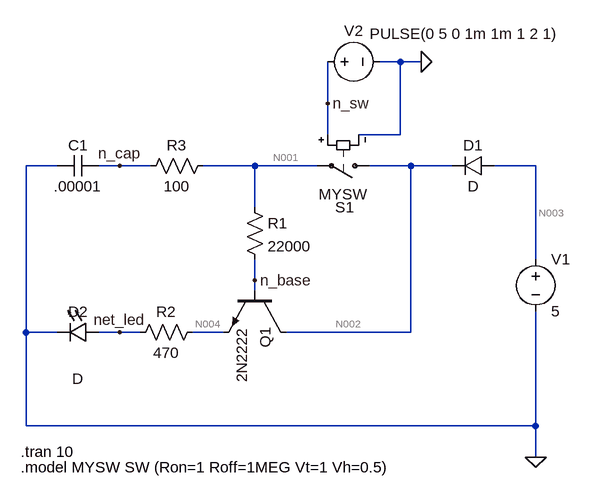
[diagram p0: schematic electronics_capacitor_drives_transistor_keeps_led_on.asc]
electronics_capacitor_drives_transistor_keeps_led_on.asc, the LTspice schematic file:
Version 4
SHEET 1 880 680
WIRE 448 -112 416 -112
WIRE 480 -112 448 -112
WIRE 336 -48 336 -112
WIRE 336 0 336 -48
WIRE 448 0 448 -112
WIRE 448 0 384 0
WIRE -80 48 -128 48
WIRE 16 48 -16 48
WIRE 64 48 16 48
WIRE 224 48 144 48
WIRE 320 48 224 48
WIRE 464 48 400 48
WIRE 528 48 464 48
WIRE 656 48 592 48
WIRE 224 112 224 48
WIRE 656 192 656 48
WIRE 224 224 224 192
WIRE 224 240 224 224
WIRE -128 304 -128 48
WIRE -80 304 -128 304
WIRE 16 304 -16 304
WIRE 48 304 16 304
WIRE 176 304 128 304
WIRE 464 304 464 48
WIRE 464 304 272 304
WIRE -128 448 -128 304
WIRE 656 448 656 272
WIRE 656 448 -128 448
WIRE 656 496 656 448
FLAG 656 496 0
FLAG 480 -112 0
FLAG 336 -48 n_sw
FLAG 16 48 n_cap
FLAG 16 304 net_led
FLAG 224 224 n_base
SYMBOL voltage 656 176 R0
WINDOW 123 0 0 Left 0
WINDOW 39 0 0 Left 0
SYMATTR InstName V1
SYMATTR Value 5
SYMBOL diode 592 32 R90
WINDOW 0 0 32 VBottom 2
WINDOW 3 32 32 VTop 2
SYMATTR InstName D1
SYMBOL npn 272 240 R90
SYMATTR InstName Q1
SYMATTR Value 2N2222
SYMBOL res 208 96 R0
SYMATTR InstName R1
SYMATTR Value 22000
SYMBOL res 144 288 R90
WINDOW 0 0 56 VBottom 2
WINDOW 3 32 56 VTop 2
SYMATTR InstName R2
SYMATTR Value 470
SYMBOL LED -16 288 R90
WINDOW 0 0 32 VBottom 2
WINDOW 3 72 32 VTop 2
SYMATTR InstName D2
SYMBOL res 160 32 R90
WINDOW 0 0 56 VBottom 2
WINDOW 3 32 56 VTop 2
SYMATTR InstName R3
SYMATTR Value 100
SYMBOL cap -16 32 R90
WINDOW 0 0 32 VBottom 2
WINDOW 3 32 32 VTop 2
SYMATTR InstName C1
SYMATTR Value .00001
SYMBOL sw 416 48 R90
WINDOW 0 64 39 VRight 2
WINDOW 3 44 19 VRight 2
SYMATTR InstName S1
SYMATTR Value MYSW
SYMBOL voltage 320 -112 R270
WINDOW 0 32 56 VTop 2
WINDOW 3 59 226 VBottom 2
WINDOW 123 0 0 Left 0
WINDOW 39 0 0 Left 0
SYMATTR InstName V2
SYMATTR Value PULSE(0 5 0 1m 1m 1 2 1)
TEXT -136 488 Left 2 !.tran 10
TEXT -136 512 Left 2 !.model MYSW SW (Ron=1 Roff=1MEG Vt=1 Vh=0.5)

The netlist it stands for:
* electronics_capacitor_drives_transistor_keeps_led_on.asc
V1 N003 0 5
D1 N003 N002 D
Q1 N002 n_base N004 0 2N2222
R1 N001 n_base 22000
R2 N004 net_led 470
D2 net_led 0 D
R3 N001 n_cap 100
C1 n_cap 0 .00001
S1 N002 N001 n_sw 0 MYSW
V2 n_sw 0 PULSE(0 5 0 1m 1m 1 2 1)
.model D D
.lib standard.dio
.model NPN NPN
.model PNP PNP
.lib standard.bjt
.tran 10
.model MYSW SW (Ron=1 Roff=1MEG Vt=1 Vh=0.5)
.backanno
.end

* Results of the author's LTspice run, read from the files saved beside the schematic
* Operating Point, zero values left out:
*   V(n003) = 5 V
*   V(n002) = 4.36 V
*   V(n_base) = 1.547 V
*   V(n004) = 907.2 mV
*   V(n001) = 1.608 V
*   V(net_led) = 640.5 mV
*   V(n_cap) = 1.608 V
*   Ic(Q1) = 564.8 µA
*   Ib(Q1) = 2.752 µA
*   Ie(Q1) = -567.6 µA
*   I(D1) = 567.6 µA
*   I(D2) = 567.6 µA
*   I(R1) = 2.752 µA
*   I(R2) = 567.6 µA
*   I(S1) = -2.752 µA
*   I(V1) = -567.6 µA
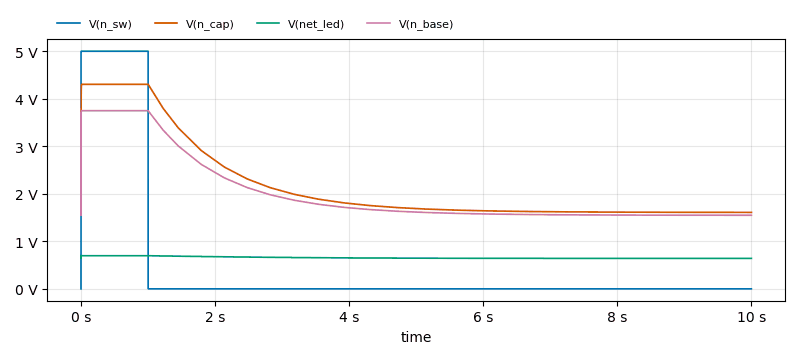
[diagram p1: Transient Analysis of electronics_capacitor_drives_transistor_keeps_led_on.asc, plotted from the saved traces]
* Transient Analysis, 1 run:
*   V(n_sw): min 0 V, max 5 V, average 500.5 mV, rms 1.582 V, last 0 V
*   V(n_cap): min 1.608 V, max 4.303 V, average 2.179 V, rms 2.357 V, last 1.609 V
*   V(net_led): min 640.5 mV, max 696.8 mV, average 656.4 mV, rms 656.7 mV, last 640.6 mV
*   V(n_base): min 1.547 V, max 3.749 V, average 2.016 V, rms 2.146 V, last 1.548 V